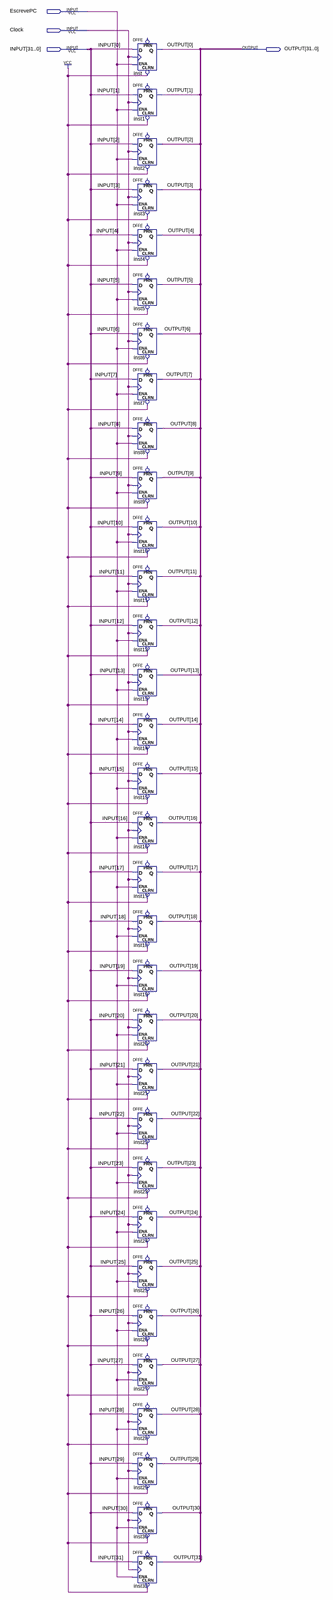
[diagram p0: schematic sheet, whole]
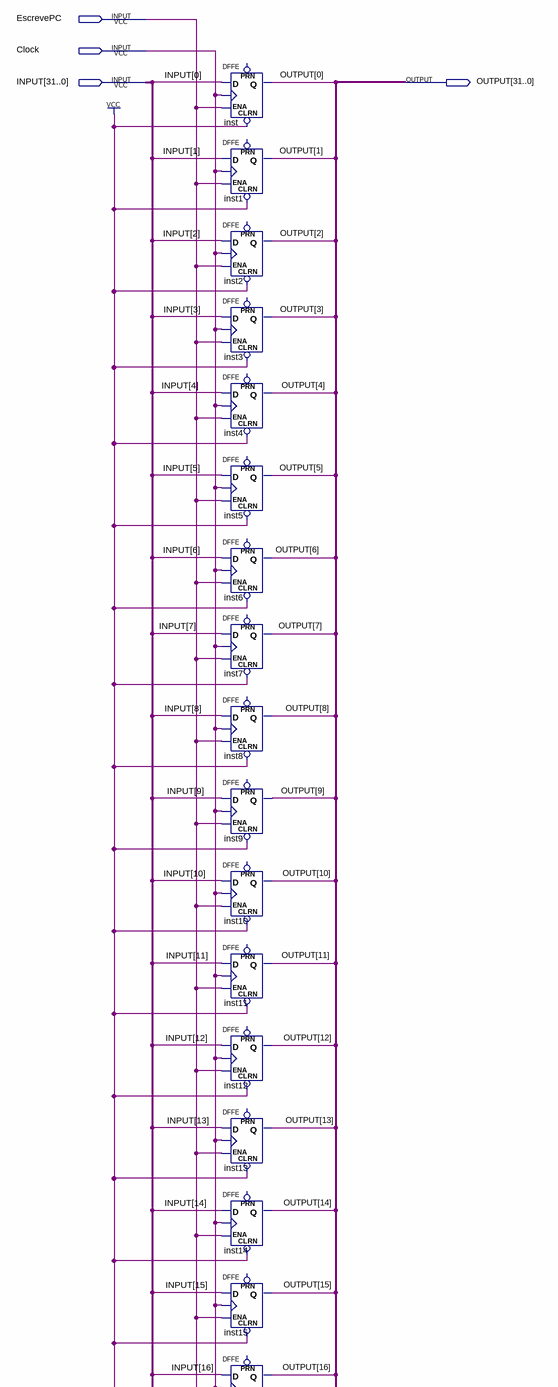
[diagram p1: schematic sheet, upper part]
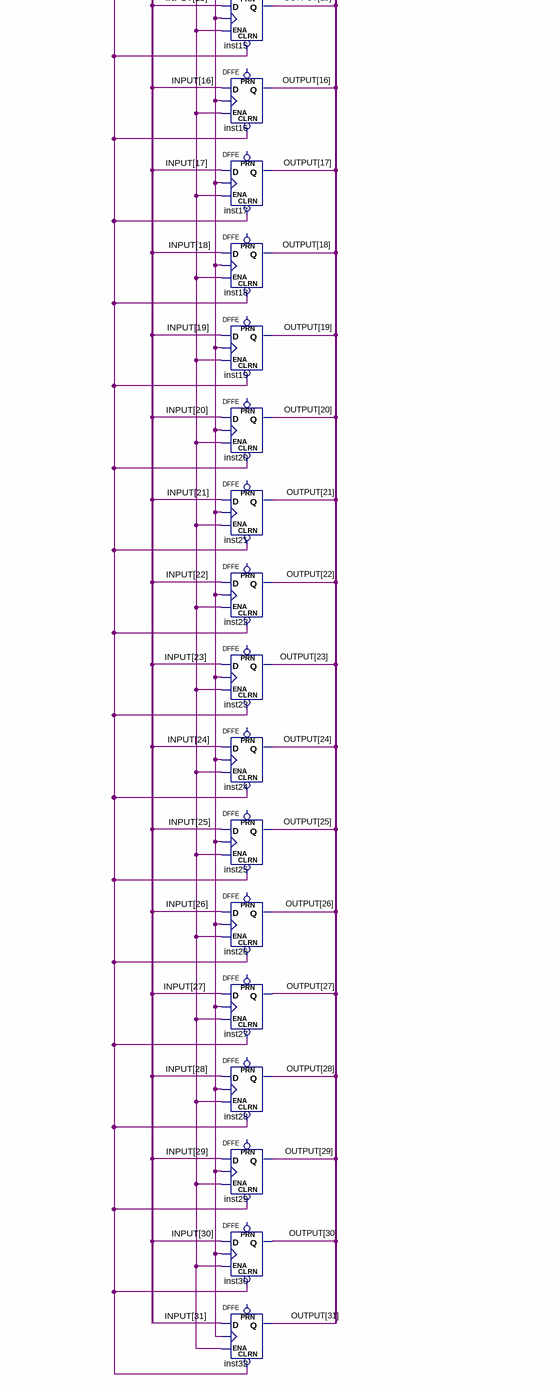
[diagram p2: schematic sheet, lower part]
// Quartus schematic PC.bdf as structural Verilog: 32 symbols, 4 pins
module PC (
  input  EscrevePC,
  input  Clock,
  input  [31:0] INPUT,
  output [31:0] OUTPUT
);

  DFFE inst (.CLRN(1'b1), .D(INPUT[0]), .CLK(Clock), .ENA(EscrevePC), .Q(OUTPUT[0]));  // open: PRN
  DFFE inst1 (.CLRN(1'b1), .D(INPUT[1]), .CLK(Clock), .ENA(EscrevePC), .Q(OUTPUT[1]));  // open: PRN
  DFFE inst2 (.CLRN(1'b1), .D(INPUT[2]), .CLK(Clock), .ENA(EscrevePC), .Q(OUTPUT[2]));  // open: PRN
  DFFE inst3 (.CLRN(1'b1), .D(INPUT[3]), .CLK(Clock), .ENA(EscrevePC), .Q(OUTPUT[3]));  // open: PRN
  DFFE inst4 (.CLRN(1'b1), .D(INPUT[4]), .CLK(Clock), .ENA(EscrevePC), .Q(OUTPUT[4]));  // open: PRN
  DFFE inst5 (.CLRN(1'b1), .D(INPUT[5]), .CLK(Clock), .ENA(EscrevePC), .Q(OUTPUT[5]));  // open: PRN
  DFFE inst6 (.CLRN(1'b1), .D(INPUT[6]), .CLK(Clock), .ENA(EscrevePC), .Q(OUTPUT[6]));  // open: PRN
  DFFE inst7 (.CLRN(1'b1), .D(INPUT[7]), .CLK(Clock), .ENA(EscrevePC), .Q(OUTPUT[7]));  // open: PRN
  DFFE inst8 (.CLRN(1'b1), .D(INPUT[8]), .CLK(Clock), .ENA(EscrevePC), .Q(OUTPUT[8]));  // open: PRN
  DFFE inst9 (.CLRN(1'b1), .D(INPUT[9]), .CLK(Clock), .ENA(EscrevePC), .Q(OUTPUT[9]));  // open: PRN
  DFFE inst10 (.CLRN(1'b1), .D(INPUT[10]), .CLK(Clock), .ENA(EscrevePC), .Q(OUTPUT[10]));  // open: PRN
  DFFE inst11 (.CLRN(1'b1), .D(INPUT[11]), .CLK(Clock), .ENA(EscrevePC), .Q(OUTPUT[11]));  // open: PRN
  DFFE inst12 (.CLRN(1'b1), .D(INPUT[12]), .CLK(Clock), .ENA(EscrevePC), .Q(OUTPUT[12]));  // open: PRN
  DFFE inst13 (.CLRN(1'b1), .D(INPUT[13]), .CLK(Clock), .ENA(EscrevePC), .Q(OUTPUT[13]));  // open: PRN
  DFFE inst14 (.CLRN(1'b1), .D(INPUT[14]), .CLK(Clock), .ENA(EscrevePC), .Q(OUTPUT[14]));  // open: PRN
  DFFE inst15 (.CLRN(1'b1), .D(INPUT[15]), .CLK(Clock), .ENA(EscrevePC), .Q(OUTPUT[15]));  // open: PRN
  DFFE inst16 (.CLRN(1'b1), .D(INPUT[16]), .CLK(Clock), .ENA(EscrevePC), .Q(OUTPUT[16]));  // open: PRN
  DFFE inst17 (.CLRN(1'b1), .D(INPUT[17]), .CLK(Clock), .ENA(EscrevePC), .Q(OUTPUT[17]));  // open: PRN
  DFFE inst18 (.CLRN(1'b1), .D(INPUT[18]), .CLK(Clock), .ENA(EscrevePC), .Q(OUTPUT[18]));  // open: PRN
  DFFE inst19 (.CLRN(1'b1), .D(INPUT[19]), .CLK(Clock), .ENA(EscrevePC), .Q(OUTPUT[19]));  // open: PRN
  DFFE inst20 (.CLRN(1'b1), .D(INPUT[20]), .CLK(Clock), .ENA(EscrevePC), .Q(OUTPUT[20]));  // open: PRN
  DFFE inst21 (.CLRN(1'b1), .D(INPUT[21]), .CLK(Clock), .ENA(EscrevePC), .Q(OUTPUT[21]));  // open: PRN
  DFFE inst22 (.CLRN(1'b1), .D(INPUT[22]), .CLK(Clock), .ENA(EscrevePC), .Q(OUTPUT[22]));  // open: PRN
  DFFE inst23 (.CLRN(1'b1), .D(INPUT[23]), .CLK(Clock), .ENA(EscrevePC), .Q(OUTPUT[23]));  // open: PRN
  DFFE inst24 (.CLRN(1'b1), .D(INPUT[24]), .CLK(Clock), .ENA(EscrevePC), .Q(OUTPUT[24]));  // open: PRN
  DFFE inst25 (.CLRN(1'b1), .D(INPUT[25]), .CLK(Clock), .ENA(EscrevePC), .Q(OUTPUT[25]));  // open: PRN
  DFFE inst26 (.CLRN(1'b1), .D(INPUT[26]), .CLK(Clock), .ENA(EscrevePC), .Q(OUTPUT[26]));  // open: PRN
  DFFE inst27 (.CLRN(1'b1), .D(INPUT[27]), .CLK(Clock), .ENA(EscrevePC), .Q(OUTPUT[27]));  // open: PRN
  DFFE inst28 (.CLRN(1'b1), .D(INPUT[28]), .CLK(Clock), .ENA(EscrevePC), .Q(OUTPUT[28]));  // open: PRN
  DFFE inst29 (.CLRN(1'b1), .D(INPUT[29]), .CLK(Clock), .ENA(EscrevePC), .Q(OUTPUT[29]));  // open: PRN
  DFFE inst30 (.CLRN(1'b1), .D(INPUT[30]), .CLK(Clock), .ENA(EscrevePC), .Q(OUTPUT[30]));  // open: PRN
  DFFE inst32 (.CLRN(1'b1), .D(INPUT[31]), .CLK(Clock), .ENA(EscrevePC), .Q(OUTPUT[31]));  // open: PRN
endmodule
